# EAGLE schematic XMICRO-7SEG (EAGLE 6.3)
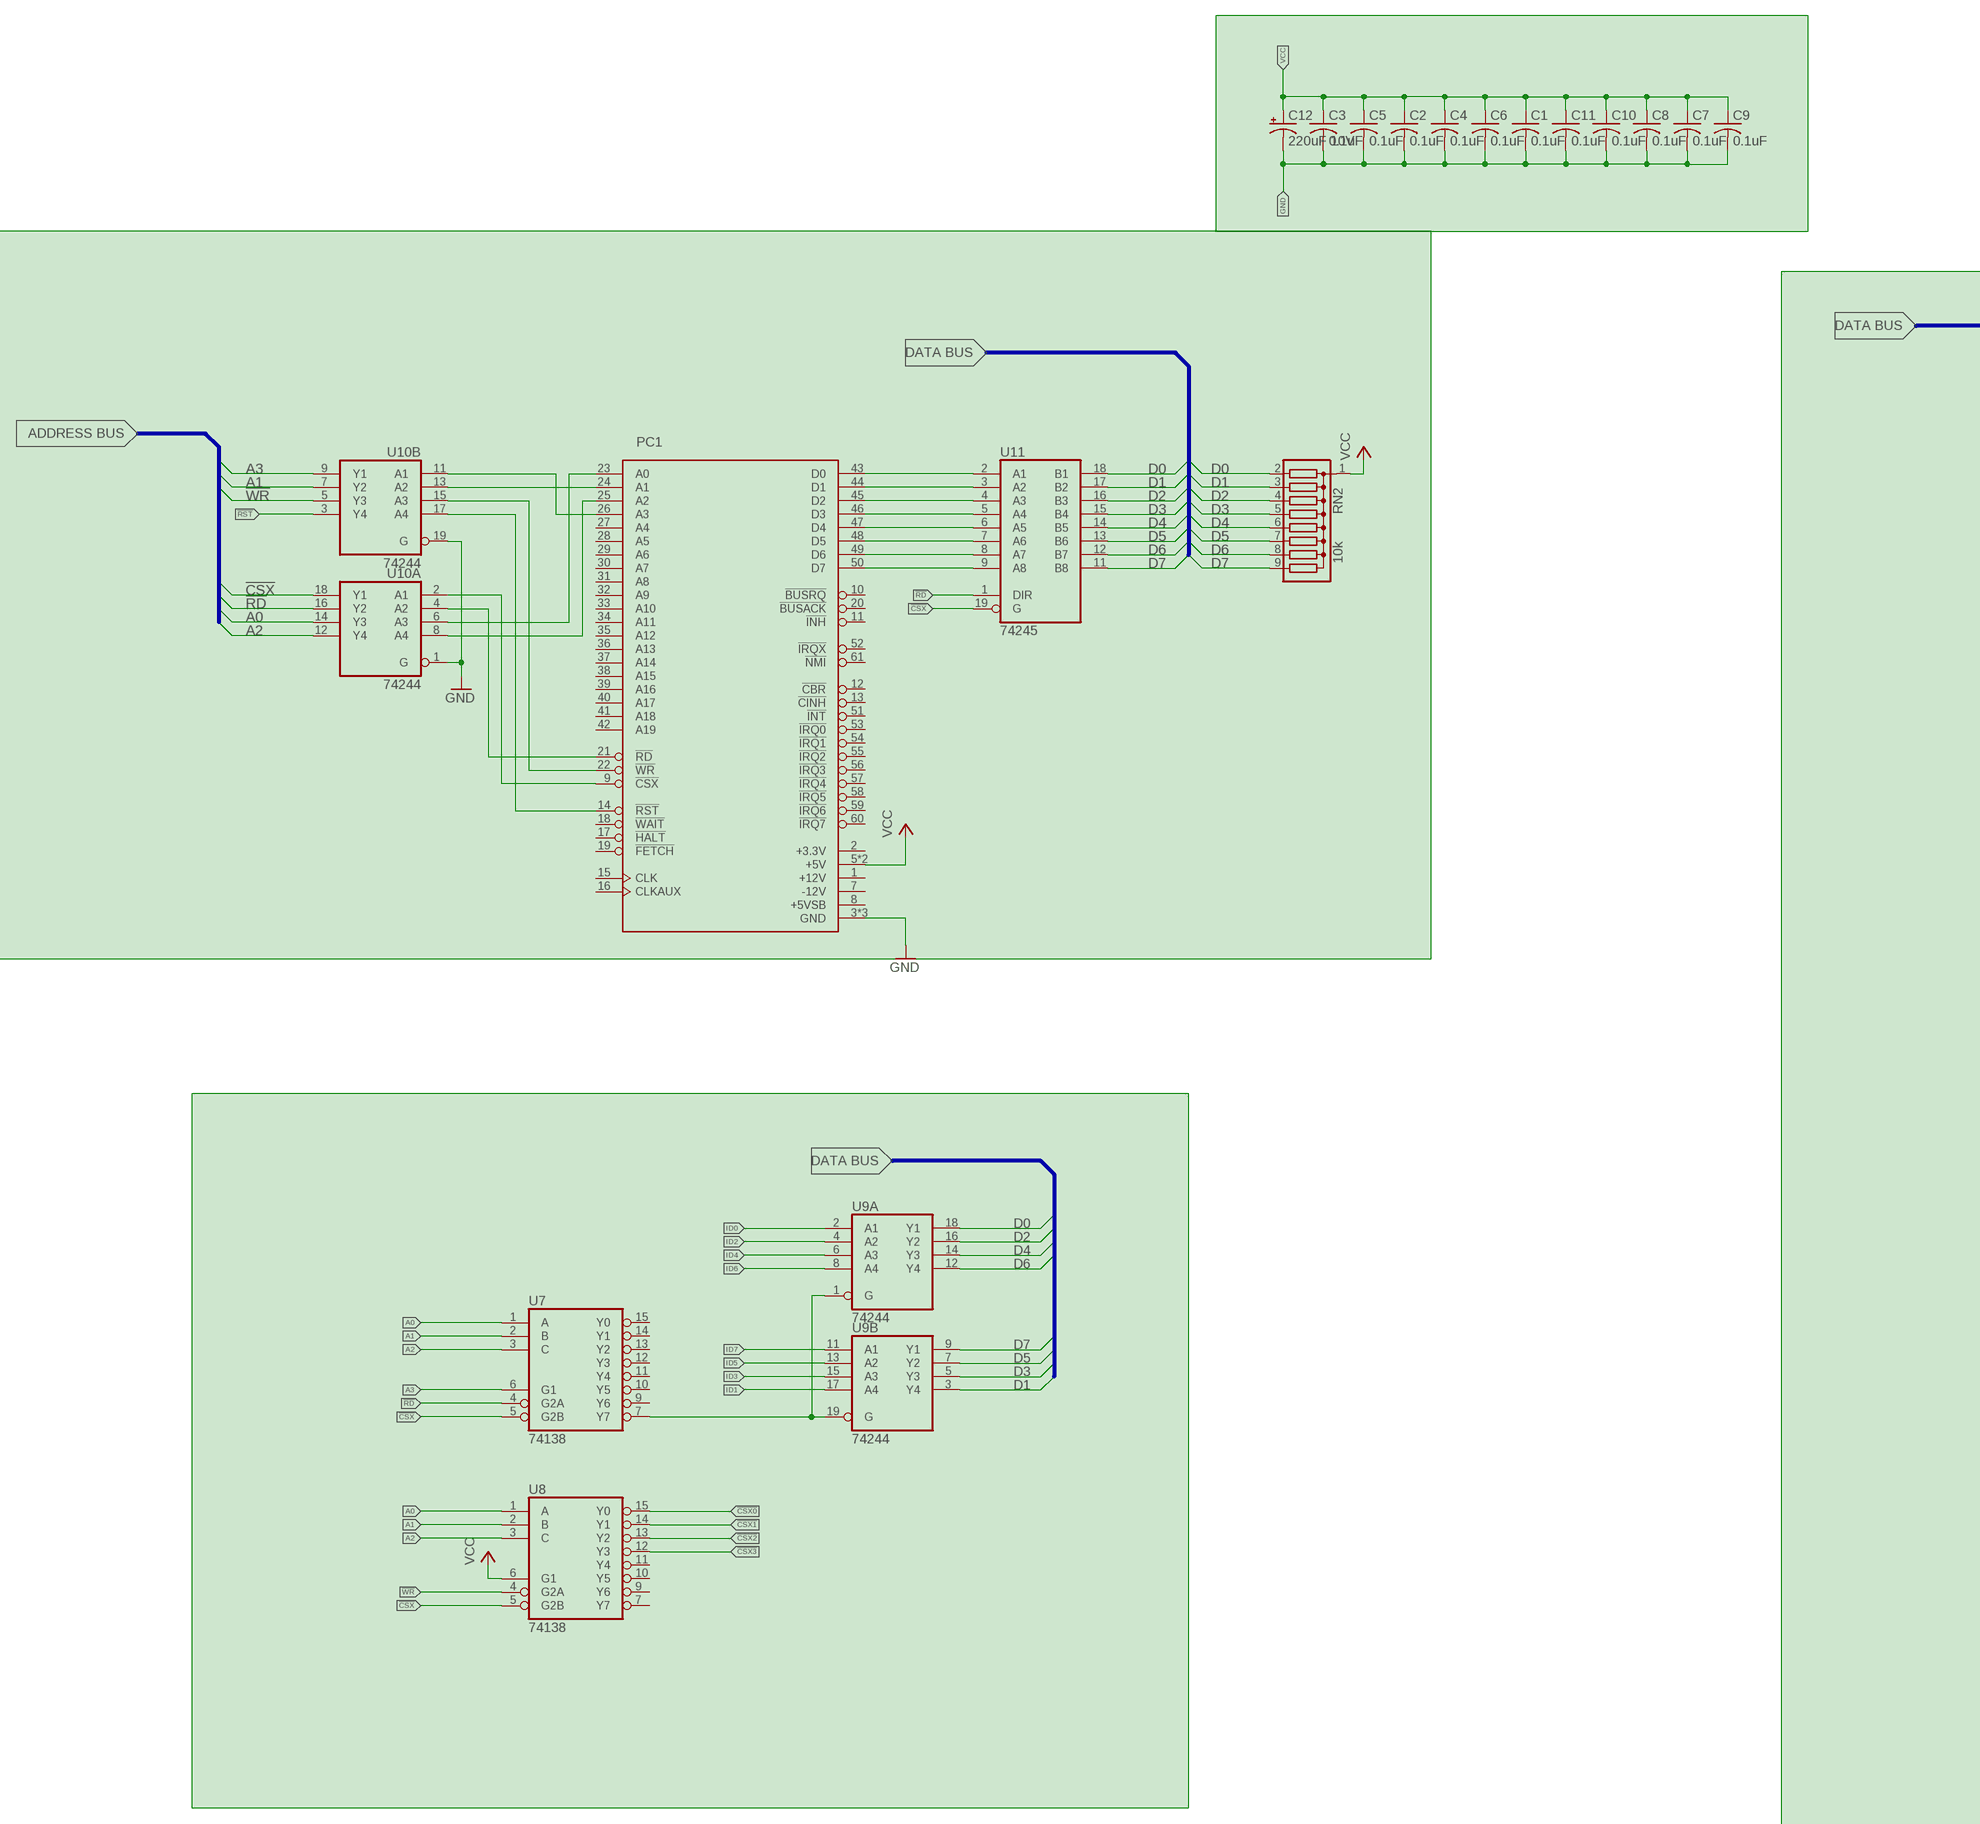
[diagram p0: schematic, sheet 1, part 1 of 2]
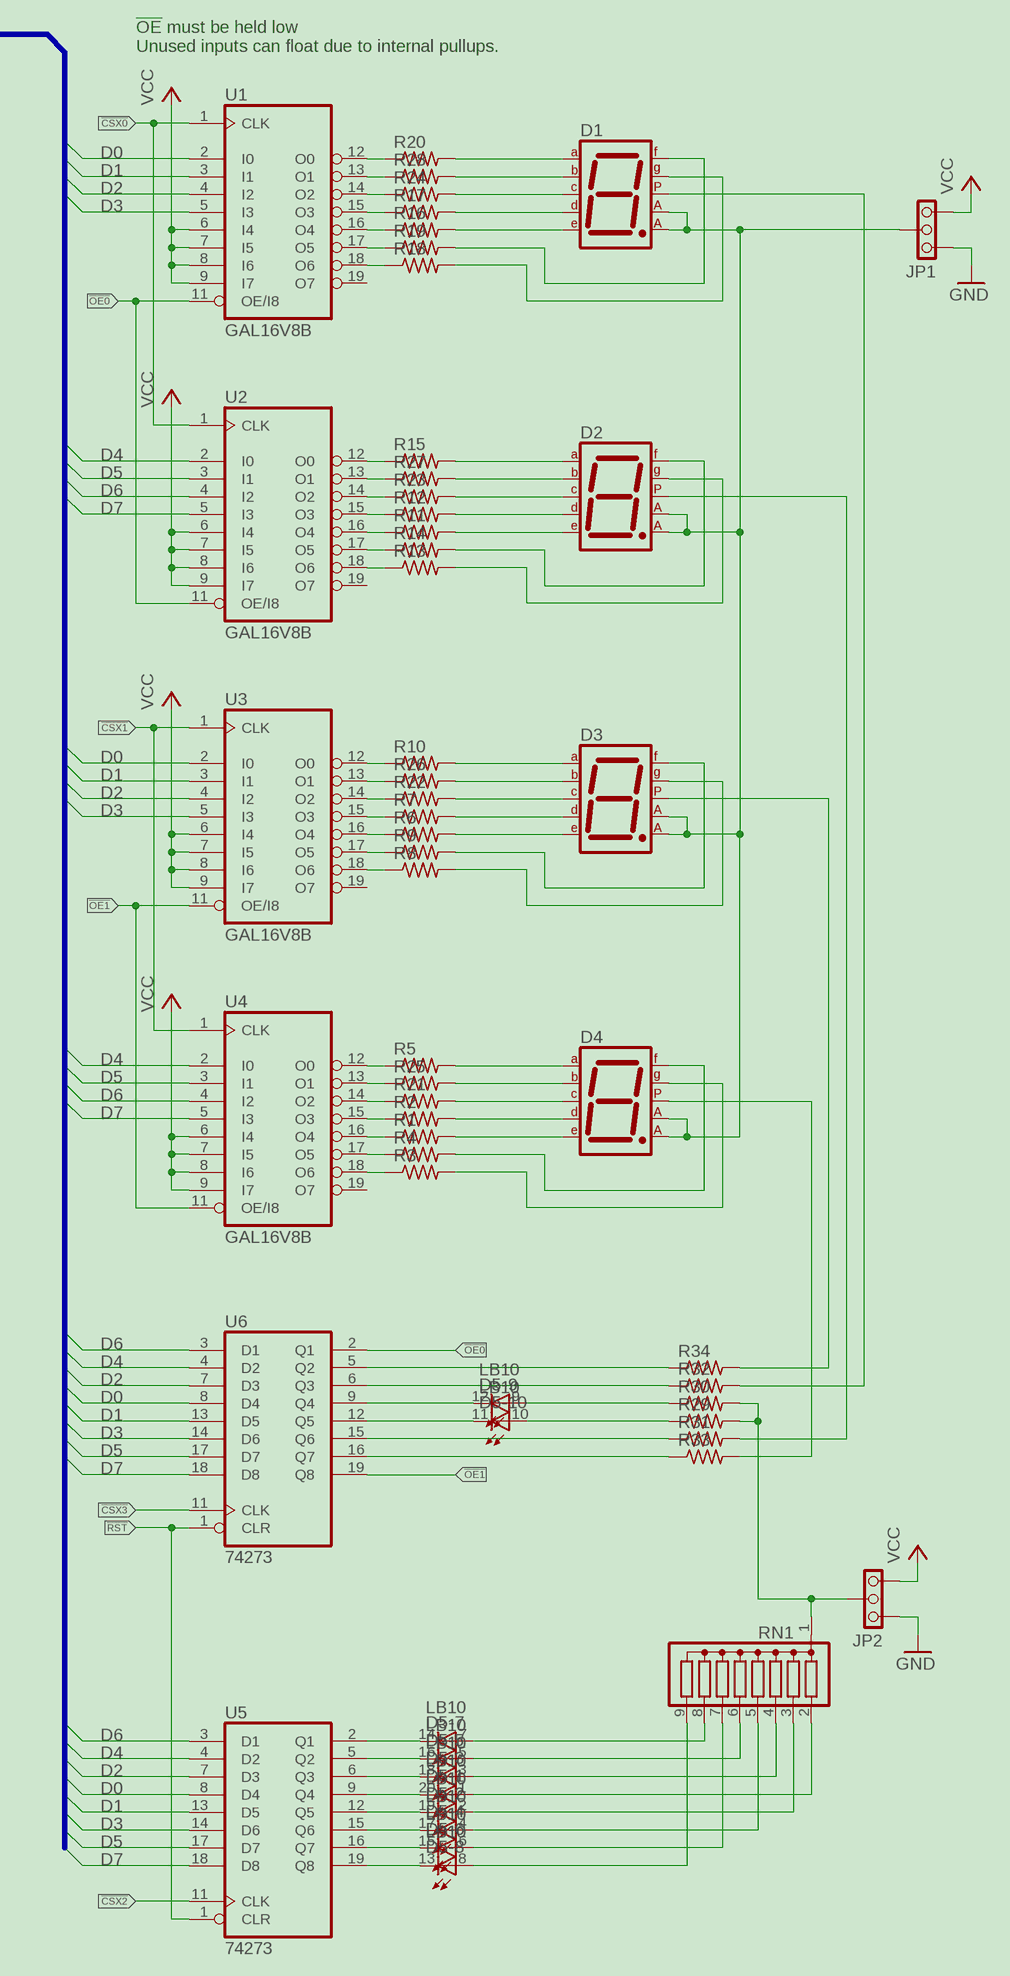
[diagram p1: schematic, sheet 1, part 2 of 2]

## Parts
C1  0.1uF  C-US025-024X044  [C025-024X044]
C2  0.1uF  C-US025-024X044  [C025-024X044]
C3  0.1uF  C-US025-024X044  [C025-024X044]
C4  0.1uF  C-US025-024X044  [C025-024X044]
C5  0.1uF  C-US025-024X044  [C025-024X044]
C6  0.1uF  C-US025-024X044  [C025-024X044]
C7  0.1uF  C-US025-024X044  [C025-024X044]
C8  0.1uF  C-US025-024X044  [C025-024X044]
C9  0.1uF  C-US025-024X044  [C025-024X044]
C10  0.1uF  C-US025-024X044  [C025-024X044]
C11  0.1uF  C-US025-024X044  [C025-024X044]
C12  220uF 10V  CPOL-US-10-5  [C-10-5]
D1  7SEG-CA  [7SEG-13]
D2  7SEG-CA  [7SEG-13]
D3  7SEG-CA  [7SEG-13]
D4  7SEG-CA  [7SEG-13]
D5  LB10  [LB10]
JP1  PINHD1X3THRU  [1X03]
JP2  PINHD1X3THRU  [1X03]
PC1  XMICRO-BUS-EDGE62M  [EDGE62M]
R1  R-US_0207/10  [0207/10]
R2  R-US_0207/10  [0207/10]
R3  R-US_0207/10  [0207/10]
R4  R-US_0207/10  [0207/10]
R5  R-US_0207/10  [0207/10]
R6  R-US_0207/10  [0207/10]
R7  R-US_0207/10  [0207/10]
R8  R-US_0207/10  [0207/10]
R9  R-US_0207/10  [0207/10]
R10  R-US_0207/10  [0207/10]
R11  R-US_0207/10  [0207/10]
R12  R-US_0207/10  [0207/10]
R13  R-US_0207/10  [0207/10]
R14  R-US_0207/10  [0207/10]
R15  R-US_0207/10  [0207/10]
R16  R-US_0207/10  [0207/10]
R17  R-US_0207/10  [0207/10]
R18  R-US_0207/10  [0207/10]
R19  R-US_0207/10  [0207/10]
R20  R-US_0207/10  [0207/10]
R21  R-US_0207/10  [0207/10]
R22  R-US_0207/10  [0207/10]
R23  R-US_0207/10  [0207/10]
R24  R-US_0207/10  [0207/10]
R25  R-US_0207/10  [0207/10]
R26  R-US_0207/10  [0207/10]
R27  R-US_0207/10  [0207/10]
R28  R-US_0207/10  [0207/10]
R29  R-US_0207/10  [0207/10]
R30  R-US_0207/10  [0207/10]
R31  R-US_0207/10  [0207/10]
R32  R-US_0207/10  [0207/10]
R33  R-US_0207/10  [0207/10]
R34  R-US_0207/10  [0207/10]
RN1  G08R  [SIL9]
RN2  10k  G08R  [SIL9]
U1  GAL16V8B  16V8  [DIL20]
U2  GAL16V8B  16V8  [DIL20]
U3  GAL16V8B  16V8  [DIL20]
U4  GAL16V8B  16V8  [DIL20]
U5  74273  74273N  [DIL20]
U6  74273  74273N  [DIL20]
U7  74138  74LS138N  [DIL16]
U8  74138  74LS138N  [DIL16]
U9  74244  74LS244N  [DIL20]
U10  74244  74LS244N  [DIL20]
U11  74245  74LS245N  [DIL20]

## Nets
!CSX: U7.5(G2B) U8.5(G2B) U10.18(A:Y1) U11.19(G)
!CSX0: U1.1(CLK) U2.1(CLK) U8.15(Y0)
!CSX1: U3.1(CLK) U4.1(CLK) U8.14(Y1)
!CSX2: U5.11(CLK) U8.13(Y2)
!CSX3: U6.11(CLK) U8.12(Y3)
!OE0: U1.11(OE/I8) U2.11(OE/I8) U6.2(Q1)
!OE1: U3.11(OE/I8) U4.11(OE/I8) U6.19(Q8)
!RD: U7.4(G2A) U10.16(A:Y2) U11.1(DIR)
!RST: U5.1(CLR) U6.1(CLR) U10.3(B:Y4)
!WR: U8.4(G2A) U10.5(B:Y3)
A0: U7.1(A) U8.1(A) U10.14(A:Y3)
A1: U7.2(B) U8.2(B) U10.7(B:Y2)
A2: U7.3(C) U8.3(C) U10.12(A:Y4)
A3: U7.6(G1) U10.9(B:Y1)
D0: RN2.2 U1.2(I0) U3.2(I0) U5.8(D4) U6.8(D4) U9.18(A:Y1) U11.18(B1)
D1: RN2.3 U1.3(I1) U3.3(I1) U5.13(D5) U6.13(D5) U9.3(B:Y4) U11.17(B2)
D2: RN2.4 U1.4(I2) U3.4(I2) U5.7(D3) U6.7(D3) U9.16(A:Y2) U11.16(B3)
D3: RN2.5 U1.5(I3) U3.5(I3) U5.14(D6) U6.14(D6) U9.5(B:Y3) U11.15(B4)
D4: RN2.6 U2.2(I0) U4.2(I0) U5.4(D2) U6.4(D2) U9.14(A:Y3) U11.14(B5)
D5: RN2.7 U2.3(I1) U4.3(I1) U5.17(D7) U6.17(D7) U9.7(B:Y2) U11.13(B6)
D6: RN2.8 U2.4(I2) U4.4(I2) U5.3(D1) U6.3(D1) U9.12(A:Y4) U11.12(B7)
D7: RN2.9 U2.5(I3) U4.5(I3) U5.18(D8) U6.18(D8) U9.9(B:Y1) U11.11(B8)
GND [GND]: C1.2 C2.2 C3.2 C4.2 C5.2 C6.2 C7.2 C8.2 C9.2 C10.2 C11.2 C12.- JP1.1 JP2.1 PC1.3(GND) PC1.4(GND) PC1.62(GND) U10.1(A:G) U10.19(B:G)
ID0: U9.2(A:A1)
ID1: U9.17(B:A4)
ID2: U9.4(A:A2)
ID3: U9.15(B:A3)
ID4: U9.6(A:A3)
ID5: U9.13(B:A2)
ID6: U9.8(A:A4)
ID7: U9.11(B:A1)
N$1: D5.12(-9:C) U6.9(Q4)
N$2: D5.11(-10:C) U6.12(Q5)
N$3: R32.1 U6.6(Q3)
N$4: R31.1 U6.15(Q6)
N$5: R33.1 U6.16(Q7)
N$6: D5.1(-1:A) RN1.2
N$7: D5.2(-2:A) RN1.3
N$8: D5.3(-3:A) RN1.4
N$9: D5.4(-4:A) RN1.5
N$10: D5.5(-5:A) RN1.6
N$11: D5.6(-6:A) RN1.7
N$12: D5.7(-7:A) RN1.8
N$13: D5.8(-8:A) RN1.9
N$14: D5.20(-1:C) U5.9(Q4)
N$15: D5.19(-2:C) U5.12(Q5)
N$16: D5.18(-3:C) U5.6(Q3)
N$17: D5.17(-4:C) U5.15(Q6)
N$18: D5.16(-5:C) U5.5(Q2)
N$19: R5.1 U4.12(O0)
N$20: R25.1 U4.13(O1)
N$21: R21.1 U4.14(O2)
N$22: R2.1 U4.15(O3)
N$23: R1.1 U4.16(O4)
N$24: R4.1 U4.17(O5)
N$25: R34.1 U6.5(Q2)
N$26: PC1.43(D0) U11.2(A1)
N$27: R3.1 U4.18(O6)
N$28: D4.7(A) R5.2
N$29: D4.6(B) R25.2
N$30: D4.4(C) R21.2
N$31: D1.3(CA1) D1.8(CA2) D2.3(CA1) D2.8(CA2) D3.3(CA1) D3.8(CA2) D4.3(CA1) D4.8(CA2) JP1.2
N$32: D5.15(-6:C) U5.16(Q7)
N$33: D5.14(-7:C) U5.2(Q1)
N$34: D5.13(-8:C) U5.19(Q8)
N$35: D4.2(D) R2.2
N$36: D4.1(E) R1.2
N$37: D4.9(F) R4.2
N$38: D4.10(G) R3.2
N$39: PC1.44(D1) U11.3(A2)
N$40: PC1.45(D2) U11.4(A3)
N$41: D5.9(-9:A) R30.1
N$42: D5.10(-10:A) R29.1
N$43: PC1.46(D3) U11.5(A4)
N$44: PC1.47(D4) U11.6(A5)
N$45: PC1.48(D5) U11.7(A6)
N$46: D4.5(DP) R33.2
N$47: R10.1 U3.12(O0)
N$48: R26.1 U3.13(O1)
N$49: R22.1 U3.14(O2)
N$50: R7.1 U3.15(O3)
N$51: R6.1 U3.16(O4)
N$52: R9.1 U3.17(O5)
N$53: R8.1 U3.18(O6)
N$54: D3.7(A) R10.2
N$55: D3.6(B) R26.2
N$56: D3.4(C) R22.2
N$57: D3.2(D) R7.2
N$58: D3.1(E) R6.2
N$59: D3.9(F) R9.2
N$60: D3.10(G) R8.2
N$61: PC1.49(D6) U11.8(A7)
N$62: PC1.50(D7) U11.9(A8)
N$63: PC1.9(!CSX) U10.2(A:A1)
N$64: PC1.14(!RST) U10.17(B:A4)
N$65: PC1.21(!RD) U10.4(A:A2)
N$66: PC1.22(!WR) U10.15(B:A3)
N$67: R15.1 U2.12(O0)
N$68: R27.1 U2.13(O1)
N$69: R23.1 U2.14(O2)
N$70: R12.1 U2.15(O3)
N$71: R11.1 U2.16(O4)
N$72: R14.1 U2.17(O5)
N$73: R13.1 U2.18(O6)
N$74: D2.7(A) R15.2
N$75: D2.6(B) R27.2
N$76: D2.4(C) R23.2
N$77: D2.2(D) R12.2
N$78: D2.1(E) R11.2
N$79: D2.9(F) R14.2
N$80: D2.10(G) R13.2
N$81: PC1.23(A0) U10.6(A:A3)
N$82: PC1.24(A1) U10.13(B:A2)
N$83: PC1.25(A2) U10.8(A:A4)
N$84: PC1.26(A3) U10.11(B:A1)
N$85: U7.7(Y7) U9.1(A:G) U9.19(B:G)
N$86: JP2.2 R29.2 R30.2 RN1.1
N$87: R20.1 U1.12(O0)
N$88: R28.1 U1.13(O1)
N$89: R24.1 U1.14(O2)
N$90: R17.1 U1.15(O3)
N$91: R16.1 U1.16(O4)
N$92: R19.1 U1.17(O5)
N$93: R18.1 U1.18(O6)
N$94: D1.7(A) R20.2
N$95: D1.6(B) R28.2
N$96: D1.4(C) R24.2
N$97: D1.2(D) R17.2
N$98: D1.1(E) R16.2
N$99: D1.9(F) R19.2
N$100: D1.10(G) R18.2
N$103: D3.5(DP) R34.2
N$104: D2.5(DP) R31.2
N$105: D1.5(DP) R32.2
VCC: C1.1 C2.1 C3.1 C4.1 C5.1 C6.1 C7.1 C8.1 C9.1 C10.1 C11.1 C12.+ JP1.3 JP2.3 PC1.5(+5V) PC1.6(+5V) RN2.1 U1.6(I4) U1.7(I5) U1.8(I6) U1.9(I7) U2.6(I4) U2.7(I5) U2.8(I6) U2.9(I7) U3.6(I4) U3.7(I5) U3.8(I6) U3.9(I7) U4.6(I4) U4.7(I5) U4.8(I6) U4.9(I7) U8.6(G1)
Unconnected: PC1.1(+12V) PC1.2(+3.3V) PC1.7(-12V) PC1.8(+5VSB) PC1.10(!BUSRQ) PC1.11(!INH) PC1.12(!CBR) PC1.13(!CINH) PC1.15(CLK) PC1.16(CLKAUX) PC1.17(!HALT) PC1.18(!WAIT) PC1.19(!FETCH) PC1.20(!BUSACK) PC1.27(A4) PC1.28(A5) PC1.29(A6) PC1.30(A7) PC1.31(A8) PC1.32(A9) PC1.33(A10) PC1.34(A11) PC1.35(A12) PC1.36(A13) PC1.37(A14) PC1.38(A15) PC1.39(A16) PC1.40(A17) PC1.41(A18) PC1.42(A19) PC1.51(!INT) PC1.52(!IRQX) PC1.53(!IRQ0) PC1.54(!IRQ1) PC1.55(!IRQ2) PC1.56(!IRQ3) PC1.57(!IRQ4) PC1.58(!IRQ5) PC1.59(!IRQ6) PC1.60(!IRQ7) PC1.61(!NMI) U1.19(O7) U2.19(O7) U3.19(O7) U4.19(O7) U7.9(Y6) U7.10(Y5) U7.11(Y4) U7.12(Y3) U7.13(Y2) U7.14(Y1) U7.15(Y0) U8.7(Y7) U8.9(Y6) U8.10(Y5) U8.11(Y4)

## Buses
D[0..7]
A[0..19],!RD,!WR,!CSX

## Notes on the sheet
- DATA BUS
- !OE! must be held low
  Unused inputs can float due to internal pullups.
- DATA BUS
- ADDRESS BUS
- DATA BUS

## Power pins joined to a net without a drawn wire
GND: U1.10(GND) U2.10(GND) U3.10(GND) U4.10(GND) U5.10(GND) U6.10(GND) U7.8(GND) U8.8(GND) U9.10(P:GND) U10.10(P:GND) U11.10(GND)
VCC: U1.20(VCC) U2.20(VCC) U3.20(VCC) U4.20(VCC) U5.20(VCC) U6.20(VCC) U7.16(VCC) U8.16(VCC) U9.20(P:VCC) U10.20(P:VCC) U11.20(VCC)

## Library data of the parts
C1-C11 = resistor:C-US: CAPACITOR, American symbol
C12 = Custom:CPOL-US
D1-D4 = special:7SEG-CA: 7-segment DISPLAY single anode, 13 mm
D5 = led:LB10: LED BLOCK 10-LED bar graph, DIL, Siemens
JP1 JP2 = Custom:PINHD1X3THRU
PC1 = Custom:XMICRO-BUS
R1-R34 = resistor:R-US_: RESISTOR, American symbol
RN1 RN2 = resistor-sil:G08R: SIL RESISTOR; OC_FARNELL: unknown; OC_NEWARK: unknown
U1-U4 = pal:16V8: PAL; MPN: GAL16V8D-7LPN; OC_FARNELL: 9699740; OC_NEWARK: 97K0449
U5 U6 = 74xx-us:74*273: Octal D type FLIP FLOP, clear
U7 U8 = 74xx-us:74*138: 3-line to 8-line DECODER/DEMULTIPLEXER
U9 U10 = 74xx-us:74*244: Octal BUFFER and LINE DRIVER, 3-state
U11 = 74xx-us:74*245: Octal BUS TRANSCEIVER, 3-state

## Net classes
1 GND: width 0.254 mm, clearance 0.381 mm